# Altium project BLACKFIN.PrjPcb
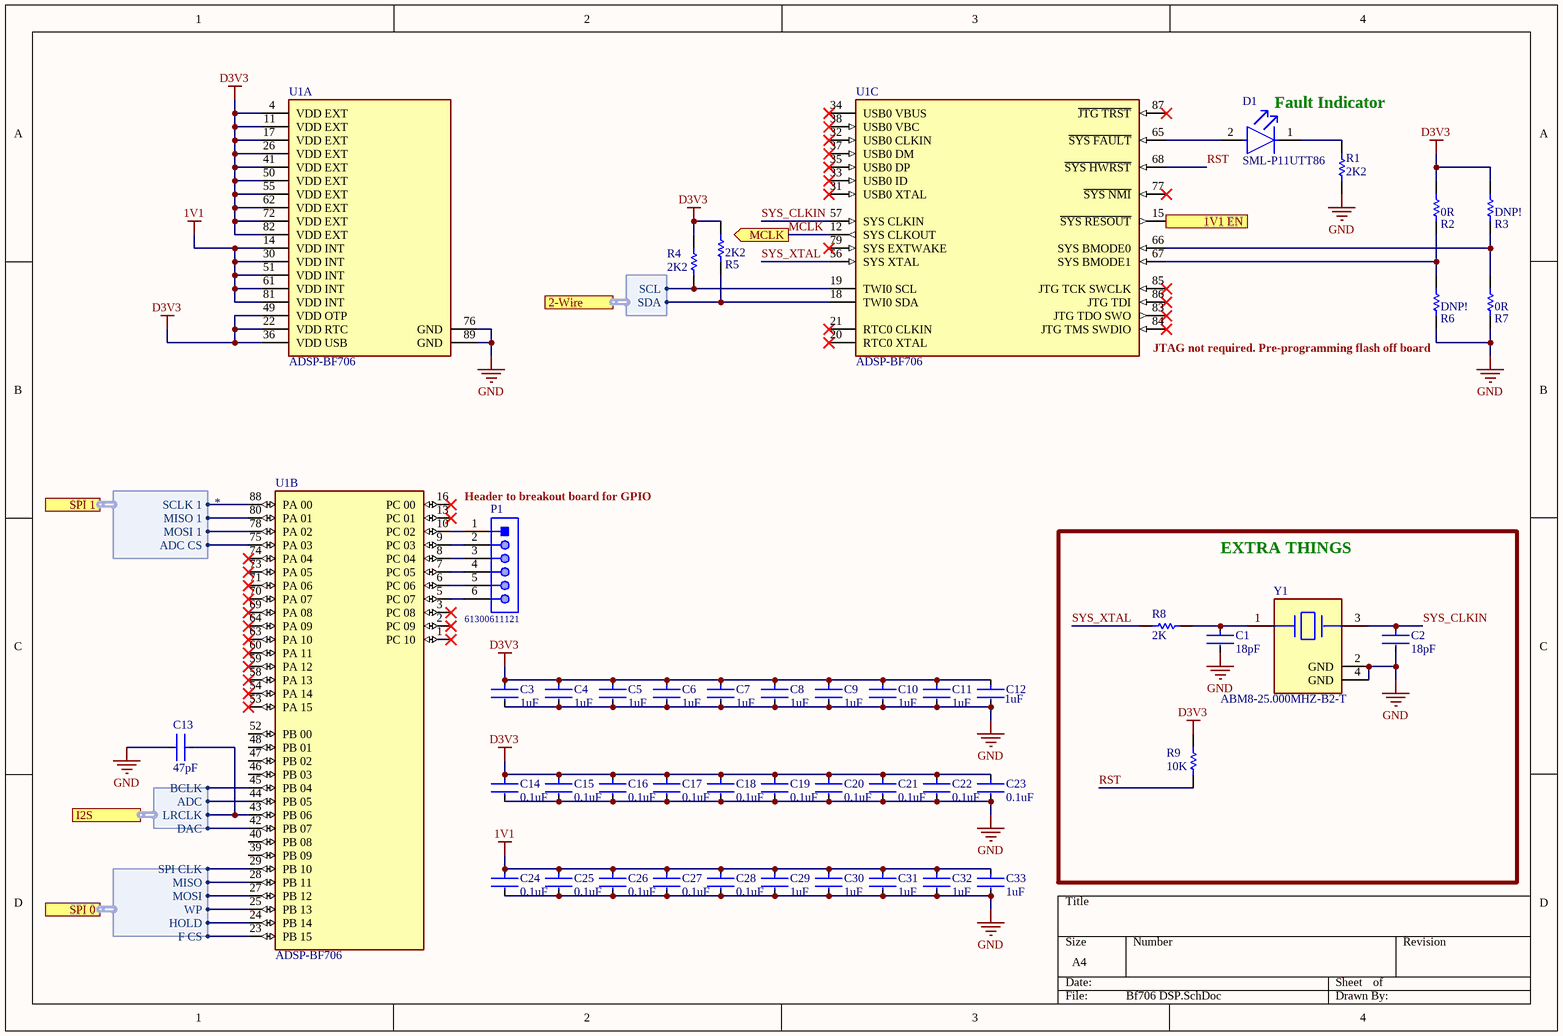
[diagram p0: Bf706 DSP.SchDoc]
5 sheets, 143 parts. Net scope: hierarchical (ports join the sheet entries above them; power ports are global).
Board file: Bing Bong.PcbDoc
Sheets:
  Bf706 DSP.SchDoc
  CODEC.SchDoc
    FB1 = Filters n Buffers.SchDoc
    FB2 = Filters n Buffers.SchDoc
  SPI Stuff.SchDoc
  Power Supply.SchDoc

## Sheet Bf706 DSP.SchDoc
size A4; SheetNumber: 2; SheetTotal: 6

### Parts
C1  18pF  [FP-GRM15-MFG]
C2  18pF  [FP-GRM15-MFG]
C3  1uF  [FP-GRM15-MFG]
C4  1uF  [FP-GRM15-MFG]
C5  1uF  [FP-GRM15-MFG]
C6  1uF  [FP-GRM15-MFG]
C7  1uF  [FP-GRM15-MFG]
C8  1uF  [FP-GRM15-MFG]
C9  1uF  [FP-GRM15-MFG]
C10  1uF  [FP-GRM15-MFG]
C11  1uF  [FP-GRM15-MFG]
C12  1uF  [FP-GRM15-MFG]
C13  47pF  [FP-GRM15-MFG]
C14  0.1uF  [FP-GRM15-MFG]
C15  0.1uF  [FP-GRM15-MFG]
C16  0.1uF  [FP-GRM15-MFG]
C17  0.1uF  [FP-GRM15-MFG]
C18  0.1uF  [FP-GRM15-MFG]
C19  0.1uF  [FP-GRM15-MFG]
C20  0.1uF  [FP-GRM15-MFG]
C21  0.1uF  [FP-GRM15-MFG]
C22  0.1uF  [FP-GRM15-MFG]
C23  0.1uF  [FP-GRM15-MFG]
C24  0.1uF  [FP-GRM15-MFG]
C25  0.1uF  [FP-GRM15-MFG]
C26  0.1uF  [FP-GRM15-MFG]
C27  0.1uF  [FP-GRM15-MFG]
C28  0.1uF  [FP-GRM15-MFG]
C29  1uF  [FP-GRM15-MFG]
C30  1uF  [FP-GRM15-MFG]
C31  1uF  [FP-GRM15-MFG]
C32  1uF  [FP-GRM15-MFG]
C33  1uF  [FP-GRM15-MFG]
D1  SML-P11UTT86  [FP-SML-P11UTT86-MFG]
P1  61300611121  [61300611121]
R1  2K2  [RESC1005X40X25LL05T05]
R2  0R  [RESC1005X40X25LL05T05]
R3  DNP!  [RESC1005X40X25LL05T05]
R4  2K2  [RESC1005X40X25LL05T05]
R5  2K2  [RESC1005X40X25LL05T05]
R6  DNP!  [RESC1005X40X25LL05T05]
R7  0R  [RESC1005X40X25LL05T05]
R8  2K  [RESC1005X40X25LL05T05]
R9  10K  [RESC1005X40X25LL05T05]
U1  ADSP-BF706  [FP-CP-88-8-IPC_C]  (parts A,B,C of 3)
Y1  ABM8-25.000MHZ-B2-T  [FP-ABM8-MFG]

### Blocks framed on the sheet
EXTRA THINGS: C1 C2 R8 R9 Y1

### Ports
1V1 EN (out), 2-Wire (harness Two Wire), I2S (harness I2S), MCLK (out), SPI 0 (harness SPI), SPI 1 (harness *)

### Harnesses
Two Wire: SCL, SDA
I2S: BCLK, ADC, LRCLK, DAC
SPI: SPI CLK, MISO, MOSI, WP, HOLD, F CS
*: SCLK 1, MISO 1, MOSI 1, ADC CS

### Nets
1V1: C24.2 C25.2 C26.2 C27.2 C28.2 C29.2 C30.2 C31.2 C32.2 C33.2 U1.14(VDD_INT) U1.30(VDD_INT) U1.51(VDD_INT) U1.61(VDD_INT) U1.81(VDD_INT)
D3V3: C3.2 C4.2 C5.2 C6.2 C7.2 C8.2 C9.2 C10.2 C11.2 C12.2 C14.2 C15.2 C16.2 C17.2 C18.2 C19.2 C20.2 C21.2 C22.2 C23.2 R2.2 R3.2 R4.2 R5.2 R9.2 U1.4(VDD_EXT) U1.11(VDD_EXT) U1.17(VDD_EXT) U1.22(VDD_RTC) U1.26(VDD_EXT) U1.36(VDD_USB) U1.41(VDD_EXT) U1.49(VDD_OTP) U1.50(VDD_EXT) U1.55(VDD_EXT) U1.62(VDD_EXT) U1.72(VDD_EXT) U1.82(VDD_EXT)
GND: C1.1 C2.1 C3.1 C4.1 C5.1 C6.1 C7.1 C8.1 C9.1 C10.1 C11.1 C12.1 C13.1 C14.1 C15.1 C16.1 C17.1 C18.1 C19.1 C20.1 C21.1 C22.1 C23.1 C24.1 C25.1 C26.1 C27.1 C28.1 C29.1 C30.1 C31.1 C32.1 C33.1 R1.1 R6.1 R7.1 U1.76(GND) U1.89(GND) Y1.2(GND) Y1.4(GND)
MCLK: U1.12(SYS_CLKOUT) ; port MCLK
RST: R9.1 U1.68(~{SYS_HWRST})
SYS_CLKIN: C2.2 U1.57(SYS_CLKIN) Y1.3
SYS_XTAL: R8.2 U1.56(SYS_XTAL)
NetC1_2: C1.2 R8.1 Y1.1
NetC13_2: C13.2 U1.43(PB_06) ; port I2S.LRCLK
NetD1_1: D1.1(C) R1.2
NetD1_2: D1.2(A) U1.65(~{SYS_FAULT})
NetP1_1: P1.1 U1.10(PC_02)
NetP1_2: P1.2 U1.9(PC_03)
NetP1_3: P1.3 U1.8(PC_04)
NetP1_4: P1.4 U1.7(PC_05)
NetP1_5: P1.5 U1.6(PC_06)
NetP1_6: P1.6 U1.5(PC_07)
NetR2_1: R2.1 R6.2 U1.67(SYS_BMODE1)
NetR3_1: R3.1 R7.2 U1.66(SYS_BMODE0)
NetR4_1: R4.1 U1.19(TWI0_SCL) ; port 2-Wire.SCL
NetR5_1: R5.1 U1.18(TWI0_SDA) ; port 2-Wire.SDA
NetU1_15: U1.15(~{SYS_RESOUT}) ; port 1V1 EN
NetU1_23: U1.23(PB_15) ; port SPI 0.F CS
NetU1_24: U1.24(PB_14) ; port SPI 0.HOLD
NetU1_25: U1.25(PB_13) ; port SPI 0.WP
NetU1_27: U1.27(PB_12) ; port SPI 0.MOSI
NetU1_28: U1.28(PB_11) ; port SPI 0.MISO
NetU1_29: U1.29(PB_10) ; port SPI 0.SPI CLK
NetU1_42: U1.42(PB_07) ; port I2S.DAC
NetU1_44: U1.44(PB_05) ; port I2S.ADC
NetU1_45: U1.45(PB_04) ; port I2S.BCLK
NetU1_75: U1.75(PA_03) ; port SPI 1.ADC CS
NetU1_78: U1.78(PA_02) ; port SPI 1.MOSI 1
NetU1_80: U1.80(PA_01) ; port SPI 1.MISO 1
NetU1_88: U1.88(PA_00) ; port SPI 1.SCLK 1

Not connected (* = marked no-connect by the designer): U1 1(PC_10)* 2(PC_09)* 3(PC_08)* 13(PC_01)* 16(PC_00)* 20(RTC0_XTAL)* 21(RTC0_CLKIN)* 31(USB0_XTAL)* 32(USB0_CLKIN)* 33(USB0_ID)* 34(USB0_VBUS)* 35(USB0_DP)* 37(USB0_DM)* 38(USB0_VBC)* 39(PB_09) 40(PB_08) 46(PB_03) 47(PB_02) 48(PB_01) 52(PB_00) 53(PA_15)* 54(PA_14)* 58(PA_13)* 59(PA_12)* 60(PA_11)* 63(PA_10)* 64(PA_09)* 69(PA_08)* 70(PA_07)* 71(PA_06)* 73(PA_05)* 74(PA_04)* 77(~{SYS_NMI})* 79(SYS_EXTWAKE)* 83(JTG_TDO_SWO)* 84(JTG_TMS_SWDIO)* 85(JTG_TCK_SWCLK)* 86(JTG_TDI)* 87(~{JTG_TRST})*

### Notes on the sheet
- Fault Indicator
- (near U1) JTAG not required. Pre-programming flash off board
- Header to breakout board for GPIO

### Library data of the parts
C1-C33 = CMP-2100-03641-2: CAP CER 0.1UF 16V X7R 0402; Manufacturer Part Number: GRM155R71C104KA88D; Manufacturer: Murata; Standoff Height: 0mm; Tolerance: 10%; Voltage Rating: 16Vdc; Material: Ceramic; Capacitance: 0.10μF; Value: 0.10μF; RoHS: TRUE; Temperature Characteristic: X7R; Octopart: https://octopart.com/grm155r71c104ka88d-murata-196880; Digikey Description: CAP CER 0.1UF 16V X7R 0402; Device Class L3: Ceramic Capacitors; Height: 0.55mm; ComponentLink2Description: Datasheet; Temperature Range Low: -55°C; Ipc Land Pattern Name: CAPC10050X219; ComponentLink2URL: https://search.murata.co.jp/Ceramy/image/img/A01X/G101/ENG/GRM155R71H471KA01-01A.pdf; Device Class L1: Passive Components; Lead Free: yes; Category: Cap; Package: GRM15; Temperature: -55°C to +125°C; Device Class L2: Capacitors; Temperature Range High: +125°C; Mouser Description: 0402 0.1 uF 16V ±10 % Tolerance X7R SMT Multilayer Ceramic Capacitor
D1 = CMP-08952-000028-1: LED RED CLEAR 1006 SMD; Number of LEDs: 1; Lens Color: Colorless; Viewing Angle: 150°; Dominant Wavelength: 621nm; Luminous Intensity: 5.5mcd; Forward Voltage: 1.8V; Lens Style: Square; Test Current: 1mA; Forward Current: 20mA; Height: 0.25mm; Radiation Hardening: No; Color: Red; Case Code (Metric): 1005; Number of Pins: 2; RoHS Compliant: Yes; Max Operating Temperature: 85°C; Package Quantity: 1; Wavelength: 621nm; Lens Transparency: Clear; Packaging: Tape and Reel; Lead Free: Lead Free; Illumination Color: Red; Case/Package: 0402; Case Code (Imperial): 0402; Mount: Surface Mount; Min Operating Temperature: -40°C; Width: 0.6mm; Length: 1mm; Series: PicoLED™; REACH SVHC: No SVHC
P1 = CMP-1502-01070-1: THT Vertical Pin Header WR-PHD, Pitch 2.54 mm, Single Row, 6 pins; Manufacturer: Wurth Elektronik; Gender: Male; Pin Number: 6; Pitch: 2.54mm; Working Voltage: 250VAC; Rated Current: 3A; Withstanding Voltage: 500VAC; Contact Resistance: 20mOhm; Operating Temperature: -40to105degC; Packaging: Bag; Datasheet URL: https://katalog.we-online.de/em/datasheet/6130xx11121.pdf; Package Reference: 61300611121; Mounting Technology: THT; Publisher: WurthElektronik; Part Number: 61300611121; Manufacturer URL: http://www.we-online.de; Row Number: Single; Orientation: Vertical
R1-R9 = CMP-2000-07451-1: Chip Resistor, 0 Ohm, 0.1 W, -55 to 155 degC, 0402 (1005 Metric), RoHS, Tape and Reel; Manufacturer: Panasonic; Voltage Rating (DC): 50V; Temperature Coefficient: 600ppm/��C; Max Power Dissipation: 100mW; Resistance: 0mOhm; Tolerance: 5%; Number of Terminations: 2; Mount: SurfaceMount; Height: 0.35mm; Packaging: TapeandReel; Contact Plating: Tin; Manufacturer URL: http://www.panasonic.com/; Composition: ThickFilm; Max Operating Temperature: 155degC; REACH SVHC: NoSVHC; Case/Package: 0402; Package Reference: 402; Depth: 0.5mm; Package Description: 2-Pin Surface Mount Device, Body 1 x 0.5 mm; Datasheet URL: https://industrial.panasonic.com/cdbs/www-data/pdf/RDA0000/AOA0000C301.pdf; RoHSCompliant: True; Case Code (Imperial): 0402; Military Standard: Not; Min Operating Temperature: -55degC; Power Rating: 100mW; Datasheet Version: 03/2015; Length: 1mm; Case Code (Metric): 1005; Termination: SMD/SMT; Mounting Technology: SurfaceMount; Voltage Rating: 50V; Width: 0.02inch; Package Quantity: 1; Lead Free: LeadFree; Radiation Hardening: No
U1 = CMP-09089-000022-1: IC DSP LP 128KB L2SR 88LFCSP; Frequency: 200MHz; Interface: I2C; Memory Size: 512KB; Number of Pins: 88; Min Operating Temperature: -40°C; Mount: Surface Mount; RoHS Compliant: Yes; Max Operating Temperature: 85°C; Lead Free: Contains Lead; Packaging: Tray; Max Frequency: 200MHz; RAM Size: 128KB
Y1 = CMP-27762-013668-1: Crystal 25MHz ±20ppm 18pF SMD-4 3.2mm x 2.5mm; ESR (Equivalent Series Resistance): 50R; Frequency Stability: 50ppm; Max Operating Temperature: 70°C; Operating Frequency: 25 MHz; Mount: Surface Mount; Case/Package: CSMD; Termination: SMD/SMT; Frequency: 25MHz; Frequency Tolerance: 20ppm; Load Capacitance: 18pF; Height: 0.031inch; Lead Free: Lead Free; Min Operating Temperature: -20°C; Depth: 2.5mm; Length: 3.2mm; Resistor Type: Ceramic; Series Resistance: 50R; Radiation Hardening: No; Series: ABM8; Width: 0.098inch; Number of Pins: 4; Package Quantity: 1000; Tolerance: 20ppm; Packaging: Tape and Reel; REACH SVHC: No SVHC

## Sheet CODEC.SchDoc
size A4; SheetNumber: 3; SheetTotal: 6
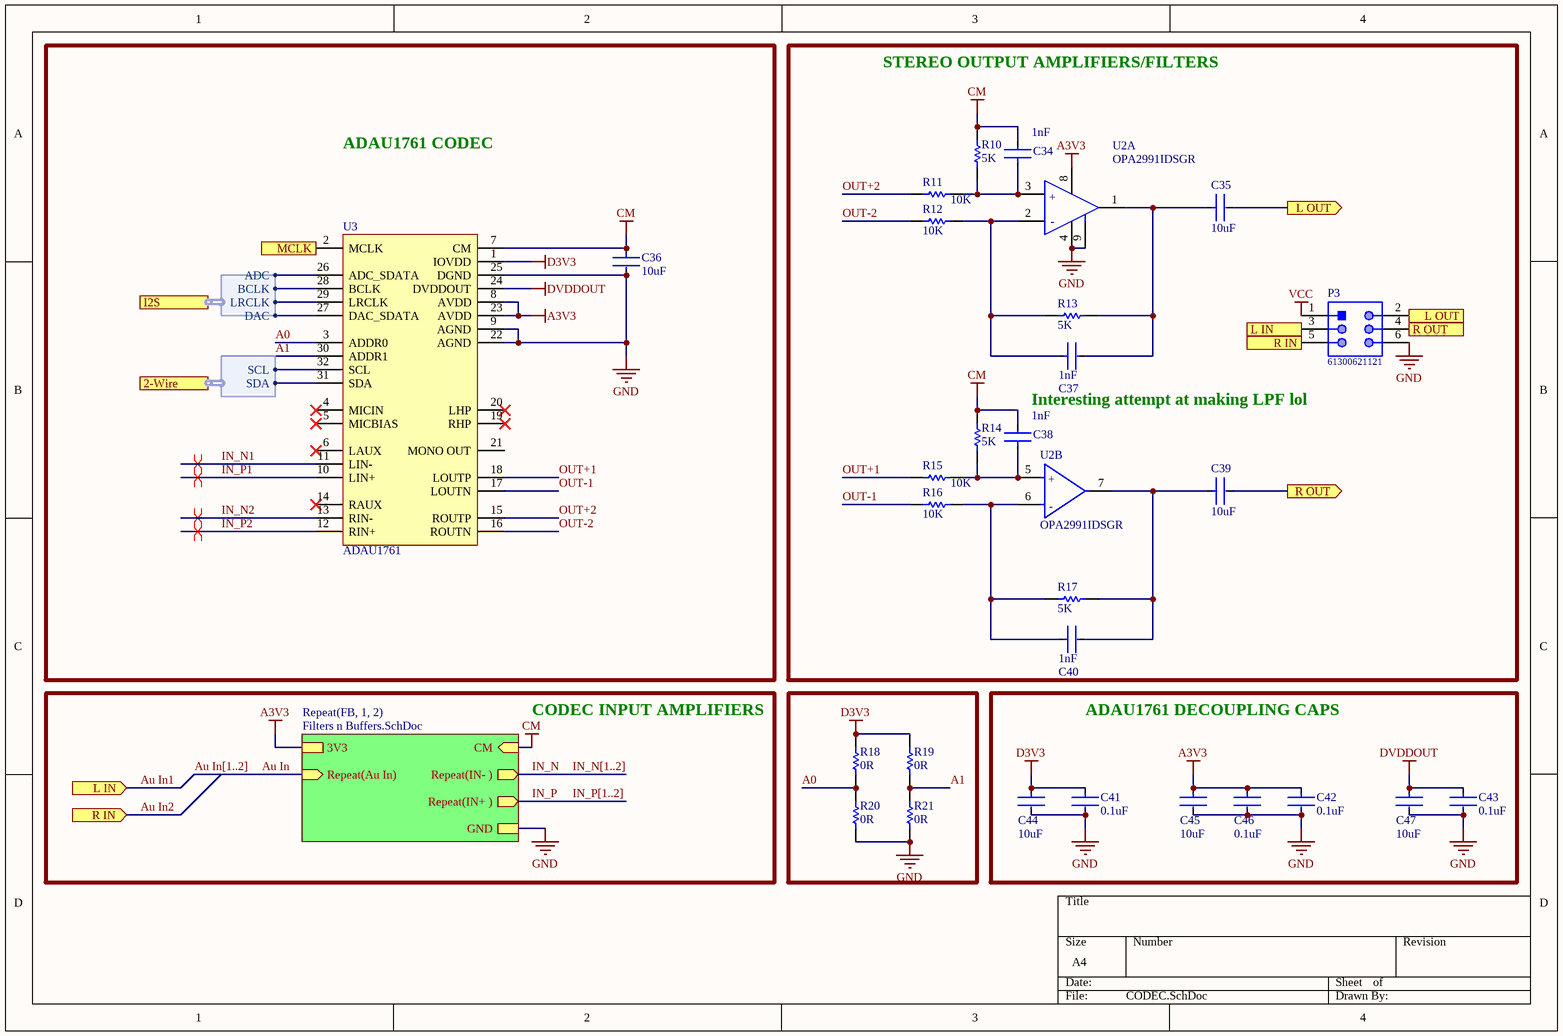
[diagram p1: CODEC.SchDoc]

### Parts
C34  1nF  [FP-GRM15-MFG]
C35  10uF  [FP-GRM15-MFG]
C36  10uF  [FP-GRM15-MFG]
C37  1nF  [FP-GRM15-MFG]
C38  1nF  [FP-GRM15-MFG]
C39  10uF  [FP-GRM15-MFG]
C40  1nF  [FP-GRM15-MFG]
C41  0.1uF  [FP-GRM15-MFG]
C42  0.1uF  [FP-GRM15-MFG]
C43  0.1uF  [FP-GRM15-MFG]
C44  10uF  [FP-GRM15-MFG]
C45  10uF  [FP-GRM15-MFG]
C46  0.1uF  [FP-GRM15-MFG]
C47  10uF  [FP-GRM15-MFG]
P3  61300621121  [61300621121]
R10  5K  [RESC1005X40X25LL05T05]
R11  10K  [RESC1005X40X25LL05T05]
R12  10K  [RESC1005X40X25LL05T05]
R13  5K  [RESC1005X40X25LL05T05]
R14  5K  [RESC1005X40X25LL05T05]
R15  10K  [RESC1005X40X25LL05T05]
R16  10K  [RESC1005X40X25LL05T05]
R17  5K  [RESC1005X40X25LL05T05]
R18  0R  [RESC1005X40X25LL05T05]
R19  0R  [RESC1005X40X25LL05T05]
R20  0R  [RESC1005X40X25LL05T05]
R21  0R  [RESC1005X40X25LL05T05]
U2  OPA2991IDSGR  [FP-DSG0008A-MFG]  (parts A,B of 2)
U3  ADAU1761  [LFCSP-32]

### Blocks framed on the sheet
ADAU1761 CODEC: C36 U3
ADAU1761 DECOUPLING CAPS: C41-C47

### Sub-sheets
Repeat(FB, 1, 2) = Filters n Buffers.SchDoc: Repeat(IN- ) (out), CM (in), Repeat(IN+ ) (out), Repeat(Au In) (in), 3V3, GND

### Ports
2-Wire (harness Two Wire), I2S (harness I2S), L IN (in), L IN (out), L OUT (in), L OUT (out), MCLK (in), R IN (in), R IN (out), R OUT (in), R OUT (out)

### Harnesses
Two Wire: SCL, SDA
I2S: ADC, BCLK, LRCLK, DAC

### Nets
A3V3: C42.2 C45.2 C46.2 U2.8(V+) U3.8(AVDD) U3.23(AVDD) ; sheet Repeat(FB, 1, 2)/3V3
CM: C34.1 C36.2 C38.1 R10.1 R14.1 U3.7(CM) ; sheet Repeat(FB, 1, 2)/CM
D3V3: C41.2 C44.2 R18.2 R19.2 U3.1(IOVDD)
DVDDOUT: C43.2 C47.2 U3.24(DVDDOUT)
GND: C36.1 C41.1 C42.1 C43.1 C44.1 C45.1 C46.1 C47.1 P3.6 R20.1 R21.1 U2.4(V-) U2.9(Thermal_Pad) U3.9(AGND) U3.22(AGND) U3.25(DGND) ; sheet Repeat(FB, 1, 2)/GND
VCC: P3.1
A0: R18.1 R20.2 U3.3(ADDR0)
A1: R19.1 R21.2 U3.30(ADDR1)
Au In: sheet Repeat(FB, 1, 2)/Repeat(Au In)
Au In1: P3.3 ; port L IN  [project net Au In]
Au In2: P3.5 ; port R IN  [project net Au In]
IN_N: sheet Repeat(FB, 1, 2)/Repeat(IN- )  [also labelled IN_N[1..2]]
IN_N1: U3.11(LIN-)  [also labelled IN_N[1..2]1]  [project net IN-]
IN_N2: U3.13(RIN-)  [also labelled IN_N[1..2]2]  [project net IN-]
IN_P: sheet Repeat(FB, 1, 2)/Repeat(IN+ )  [also labelled IN_P[1..2]]
IN_P1: U3.10(LIN+)  [also labelled IN_P[1..2]1]  [project net IN+]
IN_P2: U3.12(RIN+)  [also labelled IN_P[1..2]2]  [project net IN+]
OUT+1: R15.2 U3.18(LOUTP)
OUT+2: R11.2 U3.15(ROUTP)
OUT-1: R16.2 U3.17(LOUTN)
OUT-2: R12.2 U3.16(ROUTN)
NetC34_2: C34.2 R10.2 R11.1 U2.3(IN1+)
NetC35_1: C35.1 P3.2 ; port L OUT
NetC35_2: C35.2 C37.1 R13.2 U2.1(OUT1)
NetC37_2: C37.2 R12.1 R13.1 U2.2(IN1-)
NetC38_2: C38.2 R14.2 R15.1 U2.5(IN2+)
NetC39_1: C39.1 P3.4 ; port R OUT
NetC39_2: C39.2 C40.1 R17.2 U2.7(OUT2)
NetC40_2: C40.2 R16.1 R17.1 U2.6(IN2-)
NetU3_2: U3.2(MCLK) ; port MCLK
NetU3_26: U3.26(ADC_SDATA) ; port I2S.ADC
NetU3_27: U3.27(DAC_SDATA) ; port I2S.DAC
NetU3_28: U3.28(BCLK) ; port I2S.BCLK
NetU3_29: U3.29(LRCLK) ; port I2S.LRCLK
NetU3_31: U3.31(SDA) ; port 2-Wire.SDA
NetU3_32: U3.32(SCL) ; port 2-Wire.SCL

Not connected (* = marked no-connect by the designer): U3 4(MICIN)* 5(MICBIAS)* 6(LAUX)* 14(RAUX)* 19(RHP)* 20(LHP)* 21(MONO_OUT)

### Buses and harness runs
bus Au In[1..2]

### Layout directives
differential pair: IN+, IN-

### Notes on the sheet
- STEREO OUTPUT AMPLIFIERS/FILTERS
- Interesting attempt at making LPF lol
- CODEC INPUT AMPLIFIERS
- (in symbol CMP-04895-000388-1, part A) +; -
- (in symbol CMP-04895-000388-1, part B) +; -

### Library data of the parts
C34-C47 = CMP-2100-03641-2: as C1 on sheet Bf706 DSP; RoHS: TRUE; Temperature Characteristic: X7R; Octopart: https://octopart.com/grm155r71c104ka88d-murata-196880; Digikey Description: CAP CER 0.1UF 16V X7R 0402; Device Class L3: Ceramic Capacitors; Height: 0.55mm; ComponentLink2Description: Datasheet; Temperature Range Low: -55°C; Ipc Land Pattern Name: CAPC10050X219; ComponentLink2URL: https://search.murata.co.jp/Ceramy/image/img/A01X/G101/ENG/GRM155R71H471KA01-01A.pdf; Device Class L1: Passive Components; Lead Free: yes; Category: Cap; Package: GRM15; Temperature: -55°C to +125°C; Device Class L2: Capacitors; Temperature Range High: +125°C; Mouser Description: 0402 0.1 uF 16V ±10 % Tolerance X7R SMT Multilayer Ceramic Capacitor
P3 = CMP-1502-01072-1: THT Vertical Pin Header WR-PHD, Pitch 2.54 mm, Dual Row, 6 pins; Manufacturer: Wurth Elektronik; Contact Resistance: 20mOhm; Withstanding Voltage: 500VAC; Pin Number: 6; Gender: Male; Pitch: 2.54mm; Working Voltage: 250VAC; Rated Current: 3A; Packaging: Bag; Row Number: Dual; Manufacturer URL: http://www.we-online.de; Part Number: 61300621121; Operating Temperature: -40to105degC; Mounting Technology: THT; Package Reference: 61300621121; Datasheet URL: https://katalog.we-online.de/em/datasheet/6130xx21121.pdf; Orientation: Vertical; Publisher: WurthElektronik
R10-R21 = CMP-2000-07451-1: as R1 on sheet Bf706 DSP; Number of Terminations: 2; Mount: SurfaceMount; Height: 0.35mm; Packaging: TapeandReel; Contact Plating: Tin; Manufacturer URL: http://www.panasonic.com/; Composition: ThickFilm; Max Operating Temperature: 155degC; REACH SVHC: NoSVHC; Case/Package: 0402; Package Reference: 402; Depth: 0.5mm; Package Description: 2-Pin Surface Mount Device, Body 1 x 0.5 mm; Datasheet URL: https://industrial.panasonic.com/cdbs/www-data/pdf/RDA0000/AOA0000C301.pdf; RoHSCompliant: True; Case Code (Imperial): 0402; Military Standard: Not; Min Operating Temperature: -55degC; Power Rating: 100mW; Datasheet Version: 03/2015; Length: 1mm; Case Code (Metric): 1005; Termination: SMD/SMT; Mounting Technology: SurfaceMount; Voltage Rating: 50V; Width: 0.02inch; Package Quantity: 1; Lead Free: LeadFree; Radiation Hardening: No
U2 = CMP-04895-000388-1: IC OPAMP GP 2 CIRCUIT; RoHS Compliant: Yes
U3 = ADAU1761: Interface - CODECs Low Power Codec w/Sigma DSP

## Sheet Filters n Buffers.SchDoc
size A4; SheetNumber: 4; SheetTotal: 6
Used 2 times, as channels FB1, FB2. Parts and nets are listed once, with the designators drawn on the sheet.
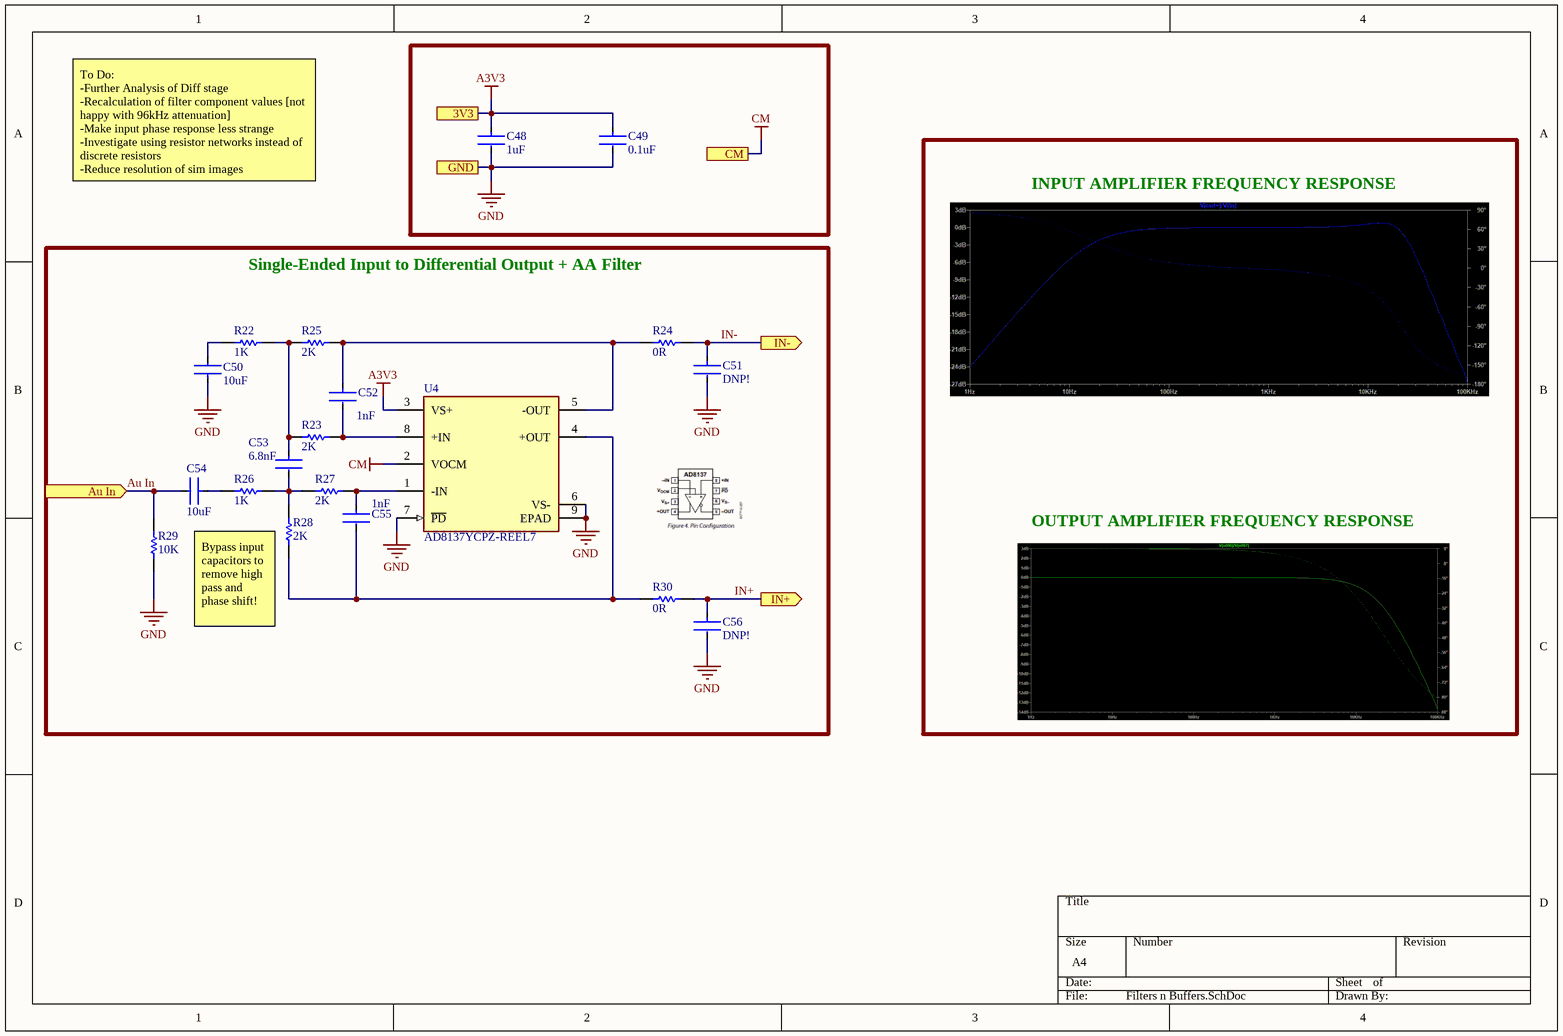
[diagram p2: Filters n Buffers.SchDoc]

### Parts
C48  1uF  [FP-GRM15-MFG]
C49  0.1uF  [FP-GRM15-MFG]
C50  10uF  [FP-GRM15-MFG]
C51  DNP!  [FP-GRM15-MFG]
C52  1nF  [FP-GRM15-MFG]
C53  6.8nF  [FP-GRM15-MFG]
C54  10uF  [FP-GRM15-MFG]
C55  1nF  [FP-GRM15-MFG]
C56  DNP!  [FP-GRM15-MFG]
R22  1K  [RESC1005X40X25LL05T05]
R23  2K  [RESC1005X40X25LL05T05]
R24  0R  [RESC1005X40X25LL05T05]
R25  2K  [RESC1005X40X25LL05T05]
R26  1K  [RESC1005X40X25LL05T05]
R27  2K  [RESC1005X40X25LL05T05]
R28  2K  [RESC1005X40X25LL05T05]
R29  10K  [RESC1005X40X25LL05T05]
R30  0R  [RESC1005X40X25LL05T05]
U4  AD8137YCPZ-REEL7  [FP-CP-8-13-IPC_C]

### Blocks framed on the sheet
Single-Ended Input to Differential Output + AA Filter: C50-C56 R22-R30 U4

### Ports
3V3, Au In (in), CM, GND, IN+ (out), IN- (out)

### Nets
A3V3: C48.2 C49.2 U4.3(VS+) ; port 3V3
CM: U4.2(VOCM) ; port CM
GND: C48.1 C49.1 C50.2 C51.1 C56.1 R29.2 U4.6(VS-) U4.7(~{PD}) U4.9(EPAD) ; port GND
Au In: C54.1 R29.1 ; port Au In
IN+: C56.2 R30.2 ; port IN+
IN-: C51.2 R24.2 ; port IN-
NetC50_1: C50.1 R22.1
NetC52_1: C52.1 R23.2 U4.8(+IN)
NetC52_2: C52.2 R24.1 R25.1 U4.5(-OUT)
NetC53_1: C53.1 R26.2 R27.1 R28.2
NetC53_2: C53.2 R22.2 R23.1 R25.2
NetC54_2: C54.2 R26.1
NetC55_1: C55.1 R28.1 R30.1 U4.4(+OUT)
NetC55_2: C55.2 R27.2 U4.1(-IN)

### Channels
FB1: designators end in _FB1; ports 3V3=A3V3 Au In=Au In CM=CM GND=GND IN+=IN+ IN-=IN-
FB2: designators end in _FB2; ports 3V3=A3V3 Au In=Au In CM=CM GND=GND IN+=IN+ IN-=IN-

### Notes on the sheet
- To Do:
  -Further Analysis of Diff stage
  -Recalculation of filter component values [not happy with 96kHz attenuation]
  -Make input phase response less strange
  -Investigate using resistor networks instead of discrete resistors
  -Reduce resolution of sim images
- INPUT AMPLIFIER FREQUENCY RESPONSE
- OUTPUT AMPLIFIER FREQUENCY RESPONSE
- (near R28) Bypass input capacitors to remove high pass and phase shift!

### Library data of the parts
C48-C56 = CMP-2100-03641-2: as C1 on sheet Bf706 DSP; RoHS: TRUE; Temperature Characteristic: X7R; Octopart: https://octopart.com/grm155r71c104ka88d-murata-196880; Digikey Description: CAP CER 0.1UF 16V X7R 0402; Device Class L3: Ceramic Capacitors; Height: 0.55mm; ComponentLink2Description: Datasheet; Temperature Range Low: -55°C; Ipc Land Pattern Name: CAPC10050X219; ComponentLink2URL: https://search.murata.co.jp/Ceramy/image/img/A01X/G101/ENG/GRM155R71H471KA01-01A.pdf; Device Class L1: Passive Components; Lead Free: yes; Category: Cap; Package: GRM15; Temperature: -55°C to +125°C; Device Class L2: Capacitors; Temperature Range High: +125°C; Mouser Description: 0402 0.1 uF 16V ±10 % Tolerance X7R SMT Multilayer Ceramic Capacitor
R22-R30 = CMP-2000-07451-1: as R1 on sheet Bf706 DSP; Number of Terminations: 2; Mount: SurfaceMount; Height: 0.35mm; Packaging: TapeandReel; Contact Plating: Tin; Manufacturer URL: http://www.panasonic.com/; Composition: ThickFilm; Max Operating Temperature: 155degC; REACH SVHC: NoSVHC; Case/Package: 0402; Package Reference: 402; Depth: 0.5mm; Package Description: 2-Pin Surface Mount Device, Body 1 x 0.5 mm; Datasheet URL: https://industrial.panasonic.com/cdbs/www-data/pdf/RDA0000/AOA0000C301.pdf; RoHSCompliant: True; Case Code (Imperial): 0402; Military Standard: Not; Min Operating Temperature: -55degC; Power Rating: 100mW; Datasheet Version: 03/2015; Length: 1mm; Case Code (Metric): 1005; Termination: SMD/SMT; Mounting Technology: SurfaceMount; Voltage Rating: 50V; Width: 0.02inch; Package Quantity: 1; Lead Free: LeadFree; Radiation Hardening: No
U4 = CMP-09116-000220-1: IC OPAMP DIFF 1 CIRCUIT 8LFCSP; Power Supply Rejection Ratio (PSRR): 79dB; Gain Bandwidth Product: 110MHz; Supply Current: 3.2mA; Number of Amplifiers: 1; Input Offset Voltage (Vos): 2.7mV; Input Resistance: 800kR; Operating Supply Current: 3.6mA; Amplifier Type: DIFFERENTIAL; Min Dual Supply Voltage: 1.35V; Max Supply Voltage: 12V; Common Mode Rejection Ratio: 66dB; Output Current per Channel: 20mA; Max Dual Supply Voltage: 6V; Settling Time: 100ns; Max Supply Current: 245uA; Voltage Gain: 89dB; Slew Rate: 450V/µs; Min Supply Voltage: 2.7V; Input Bias Current: 900nA; Number of Bits: 12; Package Quantity: 1; Max Operating Temperature: 125°C; Number of Pins: 8; RoHS Compliant: Yes; Width: 3.1mm; Nominal Supply Current: 3.2mA; Bandwidth: 110MHz; Lead Free: Contains Lead; Height: 0.8mm; Number of Circuits: 1; Number of Channels: 1; Length: 3.1mm; Series: -; Min Operating Temperature: -40°C; Radiation Hardening: No; -3db Bandwidth: 110MHz; Number of Elements: 1; Packaging: Tape and Reel; Mount: Surface Mount; Case/Package: LFCSP EP; REACH SVHC: No SVHC

## Sheet SPI Stuff.SchDoc
size A4; SheetNumber: 5; SheetTotal: 6
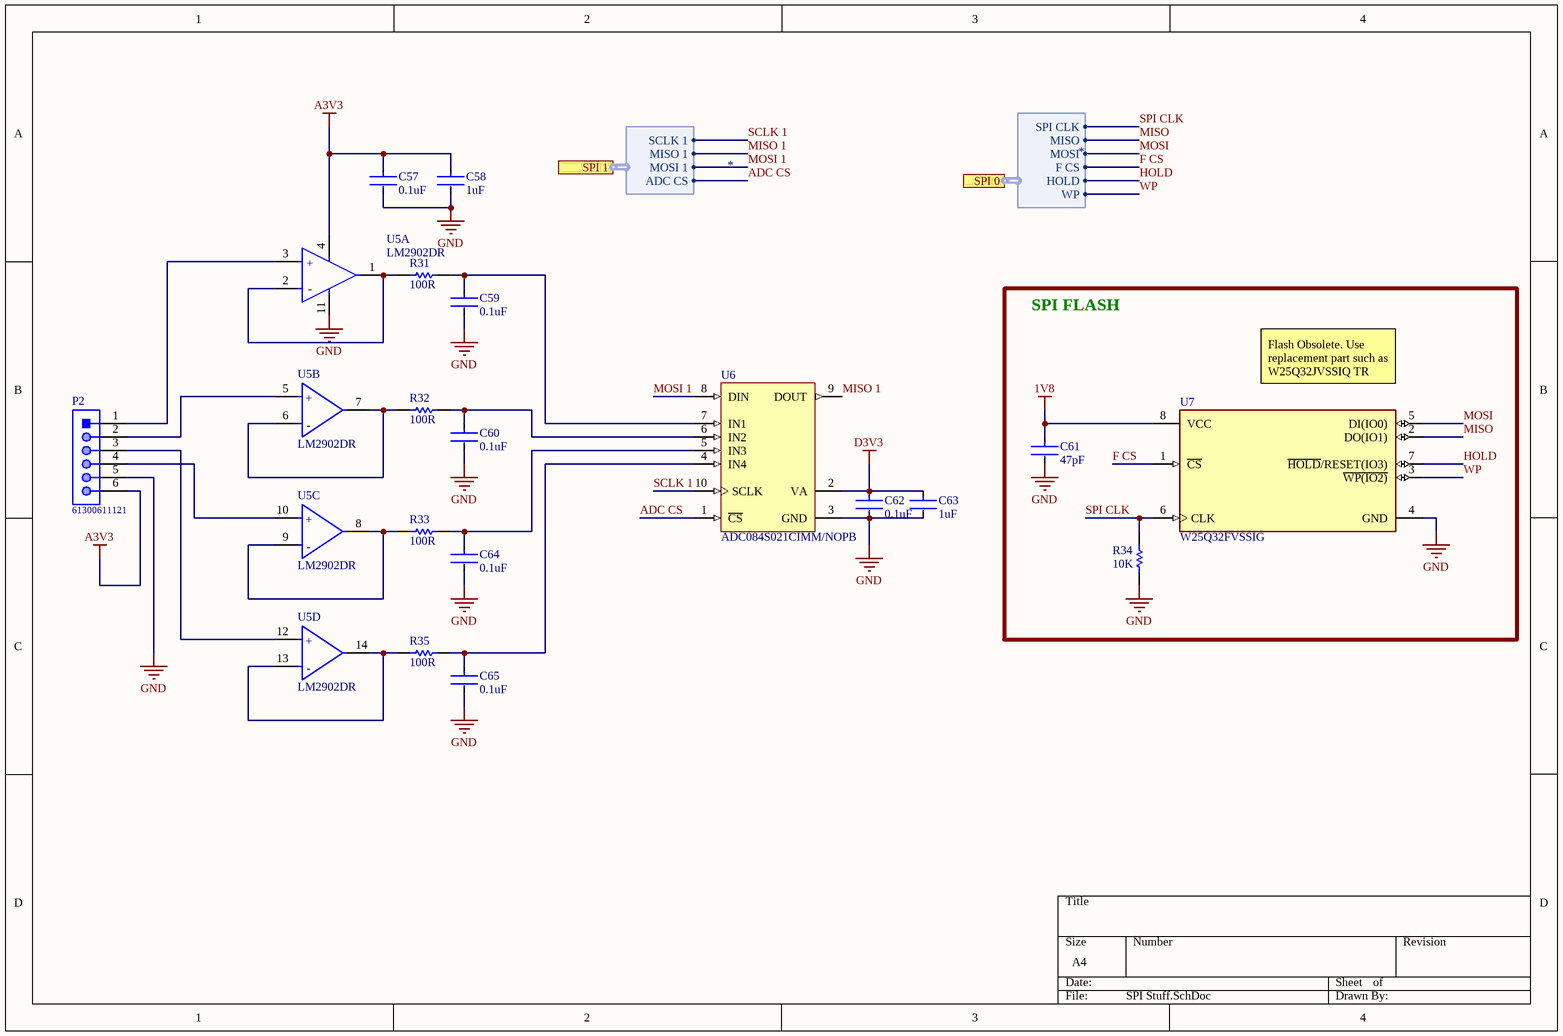
[diagram p3: SPI Stuff.SchDoc]

### Parts
C57  0.1uF  [FP-GRM15-MFG]
C58  1uF  [FP-GRM15-MFG]
C59  0.1uF  [FP-GRM15-MFG]
C60  0.1uF  [FP-GRM15-MFG]
C61  47pF  [FP-GRM15-MFG]
C62  0.1uF  [FP-GRM15-MFG]
C63  1uF  [FP-GRM15-MFG]
C64  0.1uF  [FP-GRM15-MFG]
C65  0.1uF  [FP-GRM15-MFG]
P2  61300611121  [61300611121]
R31  100R  [RESC1005X40X25LL05T05]
R32  100R  [RESC1005X40X25LL05T05]
R33  100R  [RESC1005X40X25LL05T05]
R34  10K  [RESC1005X40X25LL05T05]
R35  100R  [RESC1005X40X25LL05T05]
U5  LM2902DR  [FP-D0014A-IPC_A]  (parts A,B,C,D of 4)
U6  ADC084S021CIMM/NOPB  [MUB10A_N]
U7  W25Q32FVSSIG  [FP-SS-MFG]

### Blocks framed on the sheet
SPI FLASH: C61 R34 U7

### Ports
SPI 0 (harness *), SPI 1 (harness *)

### Harnesses
*: SPI CLK, MISO, MOSI, F CS, WP, HOLD
*: SCLK 1, MISO 1, MOSI 1, ADC CS

### Nets
1V8: C61.2 U7.8(VCC)
A3V3: C57.2 C58.2 P2.6 U5.4(VCC)
D3V3: C62.2 C63.2 U6.2(VA)
GND: C57.1 C58.1 C59.1 C60.1 C61.1 C62.1 C63.1 C64.1 C65.1 P2.5 R34.1 U5.11(GND) U6.3(GND) U7.4(GND)
ADC CS: U6.1(~{CS}) ; port SPI 1.ADC CS
F CS: U7.1(~{CS}) ; port SPI 0.F CS
HOLD: U7.7(~{HOLD}/RESET(IO3)) ; port SPI 0.HOLD
MISO: U7.2(DO(IO1)) ; port SPI 0.MISO
MISO 1: U6.9(DOUT) ; port SPI 1.MISO 1
MOSI: U7.5(DI(IO0)) ; port SPI 0.MOSI
MOSI 1: U6.8(DIN) ; port SPI 1.MOSI 1
SCLK 1: U6.10(SCLK) ; port SPI 1.SCLK 1
SPI CLK: R34.2 U7.6(CLK) ; port SPI 0.SPI CLK
WP: U7.3(~{WP(IO2)}) ; port SPI 0.WP
NetC59_2: C59.2 R31.1 U6.7(IN1)
NetC60_2: C60.2 R32.1 U6.6(IN2)
NetC64_2: C64.2 R33.1 U6.5(IN3)
NetC65_2: C65.2 R35.1 U6.4(IN4)
NetP2_1: P2.1 U5.3(1IN+)
NetP2_2: P2.2 U5.5(2IN+)
NetP2_3: P2.3 U5.12(4IN+)
NetP2_4: P2.4 U5.10(3IN+)
NetR31_2: R31.2 U5.1(1OUT) U5.2(1IN-)
NetR32_2: R32.2 U5.6(2IN-) U5.7(2OUT)
NetR33_2: R33.2 U5.8(3OUT) U5.9(3IN-)
NetR35_2: R35.2 U5.13(4IN-) U5.14(4OUT)

### Notes on the sheet
- (near U7) Flash Obsolete. Use replacement part such as W25Q32JVSSIQ TR
- (in symbol CMP-04895-000441-1, part A) +; -
- (in symbol CMP-04895-000441-1, part B) +; -
- (in symbol CMP-04895-000441-1, part C) +; -
- (in symbol CMP-04895-000441-1, part D) +; -

### Library data of the parts
C57-C65 = CMP-2100-03641-2: as C1 on sheet Bf706 DSP; RoHS: TRUE; Temperature Characteristic: X7R; Octopart: https://octopart.com/grm155r71c104ka88d-murata-196880; Digikey Description: CAP CER 0.1UF 16V X7R 0402; Device Class L3: Ceramic Capacitors; Height: 0.55mm; ComponentLink2Description: Datasheet; Temperature Range Low: -55°C; Ipc Land Pattern Name: CAPC10050X219; ComponentLink2URL: https://search.murata.co.jp/Ceramy/image/img/A01X/G101/ENG/GRM155R71H471KA01-01A.pdf; Device Class L1: Passive Components; Lead Free: yes; Category: Cap; Package: GRM15; Temperature: -55°C to +125°C; Device Class L2: Capacitors; Temperature Range High: +125°C; Mouser Description: 0402 0.1 uF 16V ±10 % Tolerance X7R SMT Multilayer Ceramic Capacitor
P2 = CMP-1502-01070-1: as P1 on sheet Bf706 DSP; Operating Temperature: -40to105degC; Packaging: Bag; Datasheet URL: https://katalog.we-online.de/em/datasheet/6130xx11121.pdf; Package Reference: 61300611121; Mounting Technology: THT; Publisher: WurthElektronik; Part Number: 61300611121; Manufacturer URL: http://www.we-online.de; Row Number: Single; Orientation: Vertical
R31-R35 = CMP-2000-07451-1: as R1 on sheet Bf706 DSP; Number of Terminations: 2; Mount: SurfaceMount; Height: 0.35mm; Packaging: TapeandReel; Contact Plating: Tin; Manufacturer URL: http://www.panasonic.com/; Composition: ThickFilm; Max Operating Temperature: 155degC; REACH SVHC: NoSVHC; Case/Package: 0402; Package Reference: 402; Depth: 0.5mm; Package Description: 2-Pin Surface Mount Device, Body 1 x 0.5 mm; Datasheet URL: https://industrial.panasonic.com/cdbs/www-data/pdf/RDA0000/AOA0000C301.pdf; RoHSCompliant: True; Case Code (Imperial): 0402; Military Standard: Not; Min Operating Temperature: -55degC; Power Rating: 100mW; Datasheet Version: 03/2015; Length: 1mm; Case Code (Metric): 1005; Termination: SMD/SMT; Mounting Technology: SurfaceMount; Voltage Rating: 50V; Width: 0.02inch; Package Quantity: 1; Lead Free: LeadFree; Radiation Hardening: No
U5 = CMP-04895-000441-1: IC OPAMP GP 4 CIRCUIT 14SOIC; Dual Supply Voltage: 9V; Min Supply Voltage: 3V; Voltage Gain: 100dB; Number of Amplifiers: 4; Nominal Supply Current: 3mA; Min Dual Supply Voltage: 1.5V; Output Current: 30mA; Common Mode Rejection Ratio: 50dB; Output Current per Channel: 60mA; Input Offset Voltage (Vos): 7mV; Input Bias Current: 250nA; Max Dual Supply Voltage: 13V; Slew Rate: 0.5V/µs; Operating Supply Current: 1.4mA; Bandwidth: 1.2MHz; Max Supply Voltage: 26V; Radiation Hardening: No; Contact Plating: Tin; Mount: Surface Mount; Width: 3.91mm; Number of Elements: 4; Number of Circuits: 4; Height: 1.58mm; Min Operating Temperature: -40°C; Length: 8.65mm; Package Quantity: 1; Packaging: Tape and Reel; Lead Free: Lead Free; Case/Package: SOIC; Number of Channels: 4; Max Operating Temperature: 125°C; REACH SVHC: No SVHC; Operating Supply Voltage: 13V; Unity Gain Bandwidth Product: 1.2MHz; Number of Pins: 14; Gain Bandwidth Product: 1.2MHz; Power Supply Rejection Ratio (PSRR): 50dB
U6 = CMP-0054-00454-2: 4 Channel, 50 kSPS to 200 kSPS, 8-Bit A/D Converter, 10-pin Mini SOIC, Pb-Free; Manufacturer: National Semiconductor; PackageTopMarking: ZXTT*X19C; PowerWise: Y; CompType: ADC IC; ComponentLink3Description: MUB10A Package Page; ComponentLink1Description: ADC084S021 Datasheet; DatasheetVersion: Aug-2008; PackageVersion: revB, Jul-2003; ComponentLink2URL: http://www.national.com/pf/AD/ADC084S021.html; RevisionNote: Component URLs added; PinCount: 10; PackageDescription: Mini-SO, Molded, .118 x .118 x .034in Body, 10 Lead, .0197in Pitch; RoHS: Y; Code_JEDEC: MO-187-BA; PackageReference: MUB10A; ComponentLink3URL: http://www.national.com/packaging/folders/mub10a.html; ComponentLink2Description: ADC084S021 Web Page; ComponentLink1URL: http://www.national.com/ds/AD/ADC084S021.pdf
U7 = CMP-2000-05006-2: IC FLASH 32M SPI 104MHZ 8SOIC; Manufacturer: Winbond; Obsolete Part: true; Access Time: 7ns; Nominal Supply Current: 8-20mA; Memory Size: 32Mbits; Max Supply Voltage: 3.6V; Min Supply Voltage: 2.7V; Standoff Height: 0.05mm; Interface: SPI,Other; Package: SS; Memory Type: FLASH; Ipc Land Pattern Name: SOIC127P790X195-8; Temperature Range High: +85°C; Temperature: -40°C to +85°C; Octopart: https://octopart.com/w25q32fvssig-winbond-23896462; Manufacturer Part Number: W25Q32FVSSIG; Ambient Temperature Range Low: -40°C; Lead Free: Yes; Height: 2.16mm; Automotive: No; Device Class L2: Memory; Digikey Description: IC FLASH 32M SPI 104MHZ 8SOIC; RoHS: TRUE; Frequency: 104MHz; Ambient Temperature Range High: +85°C; ComponentLink2Description: Datasheet; Category: IC; Device Class L1: Integrated Circuits (ICs); Device Class L3: Flash; Temperature Range Low: -40°C; Footprint Url: http://www.winbond.com/resource-files/an0000009%20spiflash%20pcb%20layout%20guideline%20v2.0%2009252017.pdf?__locale=en; ComponentLink2URL: https://www.winbond.com/resource-files/w25q32fv%20revj%2006032016.pdf

## Sheet Power Supply.SchDoc
size A4; SheetNumber: 6; SheetTotal: 6
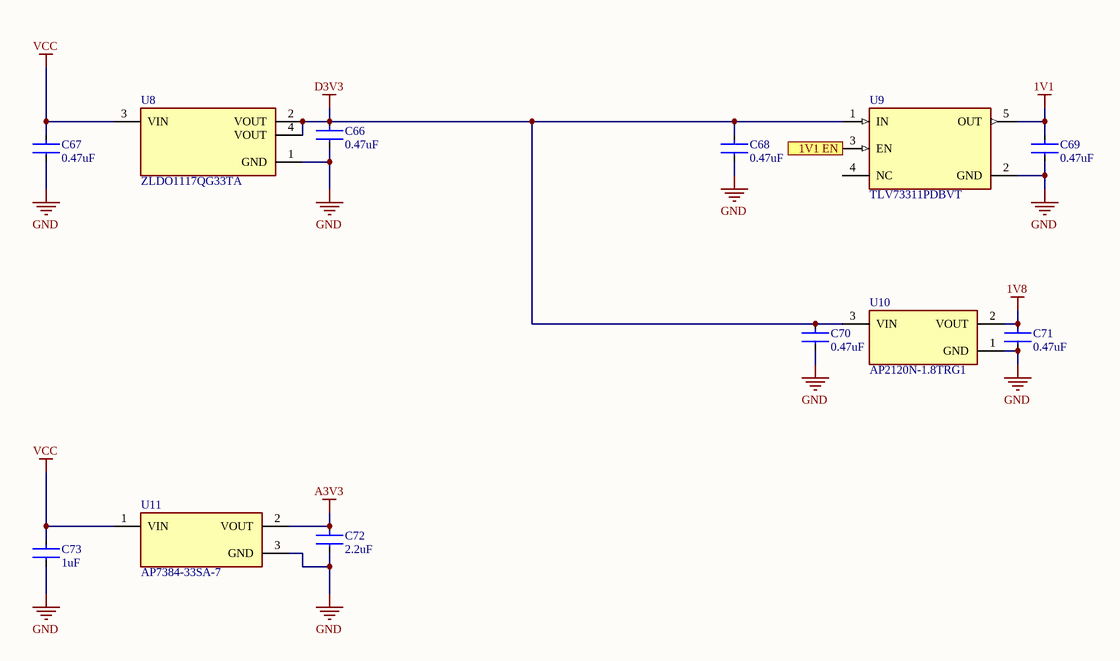
[diagram p4: Power Supply.SchDoc]

### Parts
C66  0.47uF  [FP-GRM15-MFG]
C67  0.47uF  [FP-GRM15-MFG]
C68  0.47uF  [FP-GRM15-MFG]
C69  0.47uF  [FP-GRM15-MFG]
C70  0.47uF  [FP-GRM15-MFG]
C71  0.47uF  [FP-GRM15-MFG]
C72  2.2uF  [FP-GRM15-MFG]
C73  1uF  [FP-GRM15-MFG]
U8  ZLDO1117QG33TA  [FP-SOT223-MFG]
U9  TLV73311PDBVT  [FP-DBV0005A-IPC_C]
U10  AP2120N-1.8TRG1  [FP-SOT23-IPC_A]
U11  AP7384-33SA-7  [FP-SOT23-IPC_A]

### Ports
1V1 EN (in)

### Nets
1V1: C69.2 U9.5(OUT)
1V8: C71.2 U10.2(VOUT)
A3V3: C72.2 U11.2(VOUT)
D3V3: C66.2 C68.2 C70.2 U8.2(VOUT) U8.4(VOUT) U9.1(IN) U10.3(VIN)
GND: C66.1 C67.1 C68.1 C69.1 C70.1 C71.1 C72.1 C73.1 U8.1(GND) U9.2(GND) U10.1(GND) U11.3(GND)
VCC: C67.2 C73.2 U8.3(VIN) U11.1(VIN)
NetU9_3: U9.3(EN) ; port 1V1 EN

Not connected (* = marked no-connect by the designer): U9 4(NC)

### Library data of the parts
C66-C73 = CMP-2100-03641-2: as C1 on sheet Bf706 DSP; RoHS: TRUE; Temperature Characteristic: X7R; Octopart: https://octopart.com/grm155r71c104ka88d-murata-196880; Digikey Description: CAP CER 0.1UF 16V X7R 0402; Device Class L3: Ceramic Capacitors; Height: 0.55mm; ComponentLink2Description: Datasheet; Temperature Range Low: -55°C; Ipc Land Pattern Name: CAPC10050X219; ComponentLink2URL: https://search.murata.co.jp/Ceramy/image/img/A01X/G101/ENG/GRM155R71H471KA01-01A.pdf; Device Class L1: Passive Components; Lead Free: yes; Category: Cap; Package: GRM15; Temperature: -55°C to +125°C; Device Class L2: Capacitors; Temperature Range High: +125°C; Mouser Description: 0402 0.1 uF 16V ±10 % Tolerance X7R SMT Multilayer Ceramic Capacitor
U8 = CMP-12756-000030-1: IC REG LINEAR 3.3V 1A SOT223-3; Dropout Voltage: 1.11V; Power Dissipation: 15W; Output Voltage Accuracy: 2%; Max Input Voltage: 18V; Output Type: Fixed; Number of Regulators: 1; Min Input Voltage: 2.7V; Min Current Limit: 1.1A; Quiescent Current: 10mA; Polarity: Positive; Length: 6.7mm; Min Operating Temperature: -40°C; Max Output Current: 1A; Min Output Voltage: 3.3V; Width: 3.7mm; Reference Voltage: 3.3V; Number of Pins: 3; Package Quantity: 1000; Tolerance: 2%; Max Operating Temperature: 125°C; Output Voltage: 3.3V; Accuracy: 2%; Case/Package: SOT-223; Lead Free: Lead Free; Radiation Hardening: No; Output Current: 1A; Number of Outputs: 1; Packaging: Tape and Reel; REACH SVHC: No SVHC; Max Power Dissipation: 15W; Height: 1.7mm; Mount: Surface Mount; Weight: 0.000282oz; Nominal Output Voltage: 3.3V
U9 = CMP-04917-000285-1: IC REG LINEAR 1.1V 300MA SOT23-5; Polarity: Positive; Number of Regulators: 1; Power Supply Rejection Ratio (PSRR): 68dB; Output Type: Fixed; Accuracy: 1%; Operating Supply Current: 34uA; Min Current Limit: 360mA; Quiescent Current: 60uA; Max Input Voltage: 5.5V; Min Input Voltage: 1.4V; Dropout Voltage: 460mV; Number of Pins: 5; Packaging: Tape and Reel; Max Output Current: 300mA; Mount: Surface Mount; Nominal Output Voltage: 1.1V; Output Voltage: 1.1V; REACH SVHC: No SVHC; RoHS Compliant: Yes; Output Current: 300mA; Lead Free: Lead Free; Weight: 0.000557oz; Package Quantity: 250; Min Operating Temperature: -40°C; Max Operating Temperature: 125°C; Number of Outputs: 1; Case/Package: SOT-23-5
U10 = CMP-12756-000031-1: IC REG LINEAR 1.8V 150MA SOT23; Quiescent Current: 50uA; Max Input Voltage: 6V; Accuracy: 2%; Power Supply Rejection Ratio (PSRR): 65dB; Number of Outputs: 1; Min Input Voltage: 2V; Polarity: Positive; Operating Supply Current: 25uA; Dropout Voltage: 300mV; Output Type: Fixed; Mount: Surface Mount; Packaging: Tape and Reel; Package Quantity: 3000; Weight: 0.000282oz; Lead Free: Lead Free; Width: 1.4mm; Height: 1.1mm; Length: 3mm; Output Current: 150mA; Case/Package: SOT-23; Number of Pins: 3; Max Operating Temperature: 85°C; Max Output Current: 150mA; Output Voltage: 1.8V; Number of Regulators: 1; Min Operating Temperature: -40°C
U11 = CMP-12756-000042-1: IC REG LIN 3.3V SOT23 T&R 3K; RoHS Compliant: Yes

## Nets that join several sheets
1V1: Bf706 DSP (15 pins), Power Supply (C69.2 U9.5)
1V8: SPI Stuff (C61.2 U7.8), Power Supply (C71.2 U10.2)
A3V3: CODEC (6 pins), FB1 (C48_FB1.2 C49_FB1.2 U4_FB1.3), FB2 (C48_FB2.2 C49_FB2.2 U4_FB2.3), SPI Stuff (C57.2 C58.2 P2.6 U5.4), Power Supply (C72.2 U11.2)
CM: CODEC (6 pins), FB1 (U4_FB1.2), FB2 (U4_FB2.2)
D3V3: Bf706 DSP (38 pins), CODEC (5 pins), SPI Stuff (C62.2 C63.2 U6.2), Power Supply (7 pins)
GND: Bf706 DSP (40 pins), CODEC (16 pins), FB1 (9 pins), FB2 (9 pins), SPI Stuff (14 pins), Power Supply (12 pins)
VCC: CODEC (P3.1), Power Supply (C67.2 C73.2 U8.3 U11.1)
Au In: CODEC (P3.3), FB1 (C54_FB1.1 R29_FB1.1)
Au In: CODEC (P3.5), FB2 (C54_FB2.1 R29_FB2.1)
IN+: CODEC (U3.10), FB1 (C56_FB1.2 R30_FB1.2)
IN+: CODEC (U3.12), FB2 (C56_FB2.2 R30_FB2.2)
IN-: CODEC (U3.11), FB1 (C51_FB1.2 R24_FB1.2)
IN-: CODEC (U3.13), FB2 (C51_FB2.2 R24_FB2.2)